# Altium schematic sheet Power_REV_2.SchDoc
size A
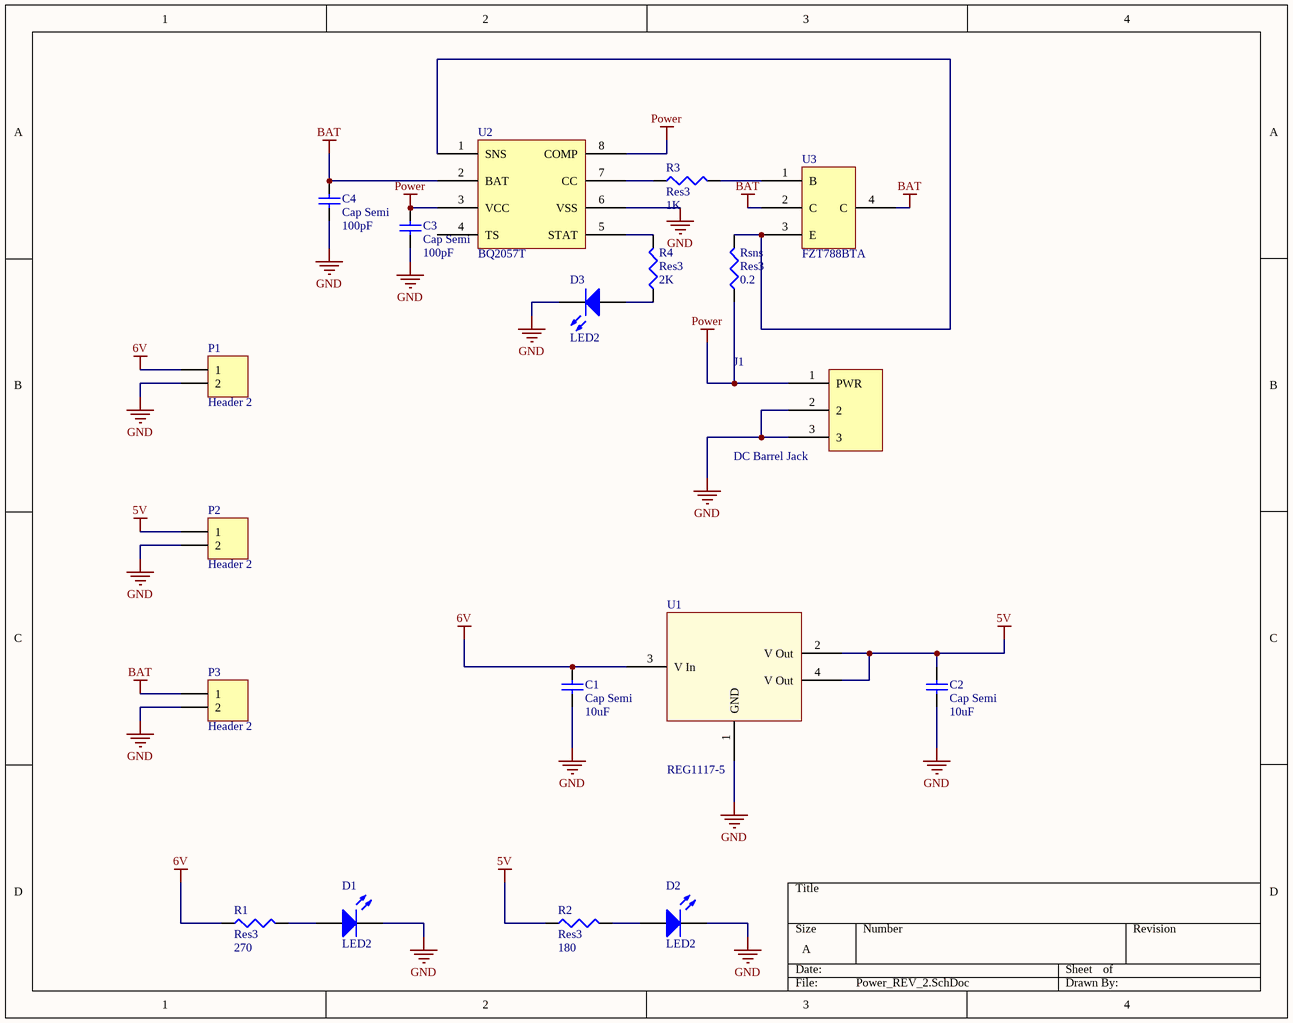
[diagram p0: Power_REV_2.SchDoc]

## Parts
C1  Cap Semi  value 10uF  [C1206]
C2  Cap Semi  value 10uF  [C1206]
C3  Cap Semi  value 100pF  [C1206]
C4  Cap Semi  value 100pF  [C1206]
D1  LED2  [3.2X1.6X1.1]
D2  LED2  [3.2X1.6X1.1]
D3  LED2  [3.2X1.6X1.1]
J1  DC Barrel Jack  [SCKT/SM4.5-2H4]
P1  Header 2  [HDR1X2]
P2  Header 2  [HDR1X2]
P3  Header 2  [HDR1X2]
R1  Res3  value 270  [J1-0603]
R2  Res3  value 180  [J1-0603]
R3  Res3  value 1K  [J1-0603]
R4  Res3  value 2K  [J1-0603]
Rsns  Res3  value 0.2  [J1-0603]
U1  REG1117-5  [SOT230P700X180-4N]
U2  BQ2057T  [SOIC127P600X178-8N]
U3  FZT788BTA  [SOT230P700X180-4N]

## Nets
5V: C2.2 P2.1 R2.1 U1.2(V_Out) U1.4(V_Out)
6V: C1.2 P1.1 R1.1 U1.3(V_In)
BAT: C4.2 P3.1 U2.2(BAT) U3.2(C) U3.4(C)
GND: C1.1 C2.1 C3.1 C4.1 D1.2(K) D2.2(K) D3.2(K) J1.2 J1.3 P1.2 P2.2 P3.2 U1.1(GND) U2.6(VSS)
Power: C3.2 J1.1(PWR) Rsns.1 U2.3(VCC) U2.8(COMP)
NetD1_1: D1.1(A) R1.2
NetD2_1: D2.1(A) R2.2
NetD3_1: D3.1(A) R4.1
NetR3_1: R3.1 U2.7(CC)
NetR3_2: R3.2 U3.1(B)
NetR4_2: R4.2 U2.5(STAT)
NetRsns_2: Rsns.2 U2.1(SNS) U3.3(E)

Not connected (* = marked no-connect by the designer): U2 4(TS)

## Library data of the parts
C1-C4 = Cap Semi: Capacitor (Semiconductor SIM Model); Published: 8-Jun-2000; LatestRevisionDate: 29-May-2009; LatestRevisionNote: IPC-7351 Footprint Added.; PackageReference: C1206; Publisher: Altium Limited; PackageDescription: Chip Capacitor
D1-D3 = LED2: Typical RED, GREEN, YELLOW, AMBER GaAs LED; Published: 8-Jun-2000; LatestRevisionDate: 17-Jul-2002; LatestRevisionNote: Re-released for DXP Platform.; PackageVersion: Feb-2002; PackageReference: 3.2X1.6X1.1; Publisher: Altium Limited; PackageDescription: SM LED; 2 Flat Leads
P1-P3 = Header 2: Header, 2-Pin; LatestRevisionDate: 17-Jul-2002; LatestRevisionNote: Re-released for DXP Platform.; Publisher: Altium Limited
R1-R4 Rsns = Res3: Resistor; Published: 8-Jun-2000; LatestRevisionDate: 29-May-2009; LatestRevisionNote: IPC-7351 Footprint Added.; PackageReference: J1-0603; Publisher: Altium Limited; PackageDescription: Chip Resistor